# Altium schematic sheet Hoja_Control.SchDoc: Hoja_Control
size A4; SheetNumber: 4; SheetTotal: 6; Time: Hoja de Control
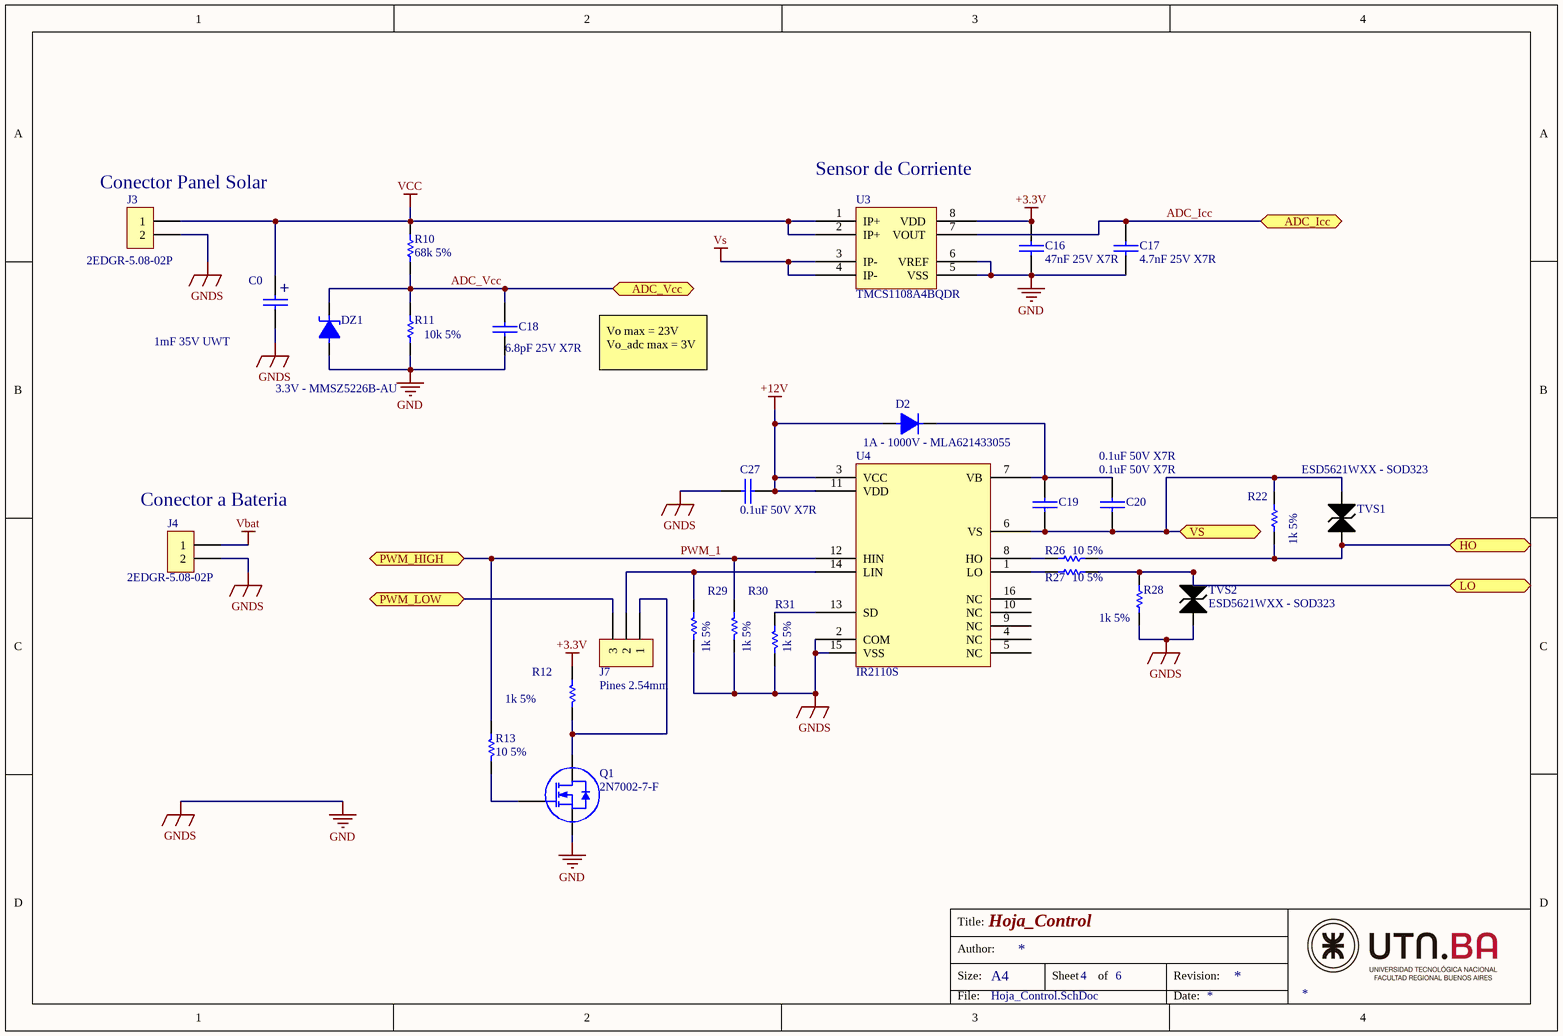
[diagram p0: Hoja_Control.SchDoc]

## Parts
C0  1mF 35V UWT  [CAPSMD8x8.3]
C16  47nF 25V X7R  [0805]
C17  4.7nF 25V X7R  [0805]
C18  6.8pF 25V X7R  [0805]
C19  0.1uF 50V X7R  [0805]
C20  0.1uF 50V X7R  [0805]
C27  0.1uF 50V X7R  [0805]
D2  1A - 1000V - MLA621433055  [DO-214AC]
DZ1  3.3V - MMSZ5226B-AU  [sod123]
J3  2EDGR-5.08-02P  [Bornera2_DegsonH]
J4  2EDGR-5.08-02P  [Bornera2_DegsonH]
J7  Pines 2.54mm  [SIP3]
Q1  2N7002-7-F  [SOT23]
R10  68k 5%  [0805]
R11  10k 5%  [0805]
R12  1k 5%  [0805]
R13  10 5%  [0805]
R22  1k 5%  [0805]
R26  10 5%  [0805]
R27  10 5%  [0805]
R28  1k 5%  [0805]
R29  1k 5%  [0805]
R30  1k 5%  [0805]
R31  1k 5%  [0805]
TVS1  ESD5621WXX - SOD323  [SOD323]
TVS2  ESD5621WXX - SOD323  [SOD323]
U3  TMCS1108A4BQDR  [SOIC8]
U4  IR2110S  [SOIC16W]

## Ports
ADC_Icc (bidir), ADC_Vcc (bidir), HO (bidir), LO (bidir), PWM_HIGH (bidir), PWM_LOW (bidir), VS (bidir)

## Nets
+3.3V: C16.1 R12.2 U3.8(VDD)
+12V: C27.1 D2.1 U4.3(VCC) U4.11(VDD)
GND: C0.2 C16.2 C17.2 C18.2 C27.2 DZ1.1 J3.2 J4.2 Q1.3(S) R11.1 R28.1 R29.1 R30.1 R31.1 TVS2.2 U3.5(VSS) U3.6(VREF) U4.2(COM) U4.15(VSS)  [also labelled GNDS]
Vbat: J4.1
VCC: C0.1 J3.1 R10.2 U3.1(IP+) U3.2(IP+)
Vs: U3.3(IP-) U3.4(IP-)
ADC_Icc: C17.1 U3.7(VOUT) ; port ADC_Icc
ADC_Vcc: C18.1 DZ1.2 R10.1 R11.2 ; port ADC_Vcc
HO: R22.1 R26.2 TVS1.2 ; port HO
LO: R27.2 R28.2 TVS2.1 ; port LO
PWM_1: R13.2 R30.2 U4.12(HIN) ; port PWM_HIGH
PWM_LOW: J7.3 ; port PWM_LOW
VS: C19.1 C20.1 R22.2 TVS1.1 U4.6(VS) ; port VS  [a separate net that carries the same name]
NetC19_2: C19.2 C20.2 D2.2 U4.7(VB)
NetJ7_1: J7.1 Q1.2(D) R12.1
NetJ7_2: J7.2 R29.2 U4.14(LIN)
NetQ1_1: Q1.1(G) R13.1
NetR26_1: R26.1 U4.8(HO)
NetR27_1: R27.1 U4.1(LO)
NetR31_2: R31.2 U4.13(SD)

Not connected (* = marked no-connect by the designer): U4 4(NC) 5(NC) 9(NC) 10(NC) 16(NC)

## Notes on the sheet
- (near U3) Sensor de Corriente
- (near J3) Conector Panel Solar
- Vo max = 23V
  Vo_adc max = 3V
- (near J4) Conector a Bateria
- Title:
- Size:
- Author:
- A4
- Sheet
- of
- Revision:
- File:
- Date:
- (in symbol CAPPOL) +

## Library data of the parts
C0 = CAPPOL: Capacitores electrolíticos de aluminio 100 µF 35 V Radial, encapsulado - terminales SMD 1000 h a 105°C. MLA621433055
C16-C18 = CAP
C19 C20 C27 = CAP: CAP CER 0.1UF X7R 0805
D2 = DIODO: Diodos Estándar 1000 V 1A Montaje en superficie SMA
DZ1 = DIODO ZENER
J3 J4 = BORNERA 2
J7 = CON3
Q1 = MOSFET N: Canal N Montaje en superficie 60 V 115mA (Ta) 370mW (Ta) SOT-23-3
R10-R13 R22 R26-R31 = RES
TVS1 TVS2 = TVS
U3 = MLX91221KDC: Sensores de corriente 1 canal Efecto Hall Bidireccional 8-SOIC (ancho 0.154", 3.90mm)
U4 = IR2110 16: Medio puente controladores de compuerta IC No inversor 14-DIP